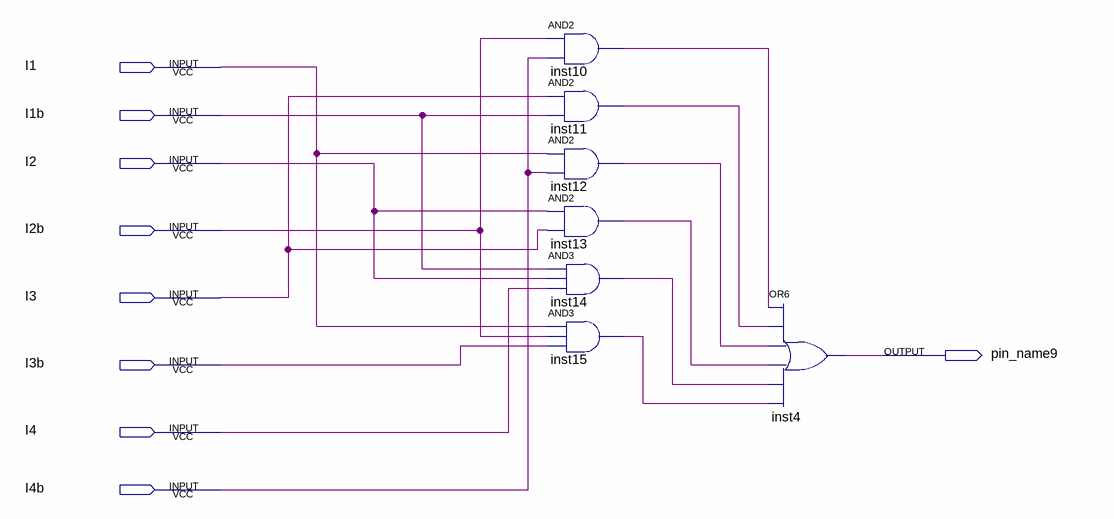
[diagram p0: schematic sheet]
// Quartus schematic funca.bdf as structural Verilog: 7 symbols, 9 pins
module funca (
  input  I1,
  input  I1b,
  input  I2,
  input  I2b,
  input  I3,
  input  I3b,
  input  I4,
  input  I4b,
  output pin_name9
);

  wire inst10_out, inst11_out, inst12_out, inst13_out, inst14_out, inst15_out;

  and inst10 (inst10_out, I2b, I4b);
  and inst11 (inst11_out, I3, I1b);
  and inst12 (inst12_out, I1, I4b);
  and inst13 (inst13_out, I2, I3);
  and inst14 (inst14_out, I1b, I2, I4);
  and inst15 (inst15_out, I1, I2b, I3b);
  or inst4 (pin_name9, inst10_out, inst11_out, inst12_out, inst13_out, inst14_out, inst15_out);
endmodule
